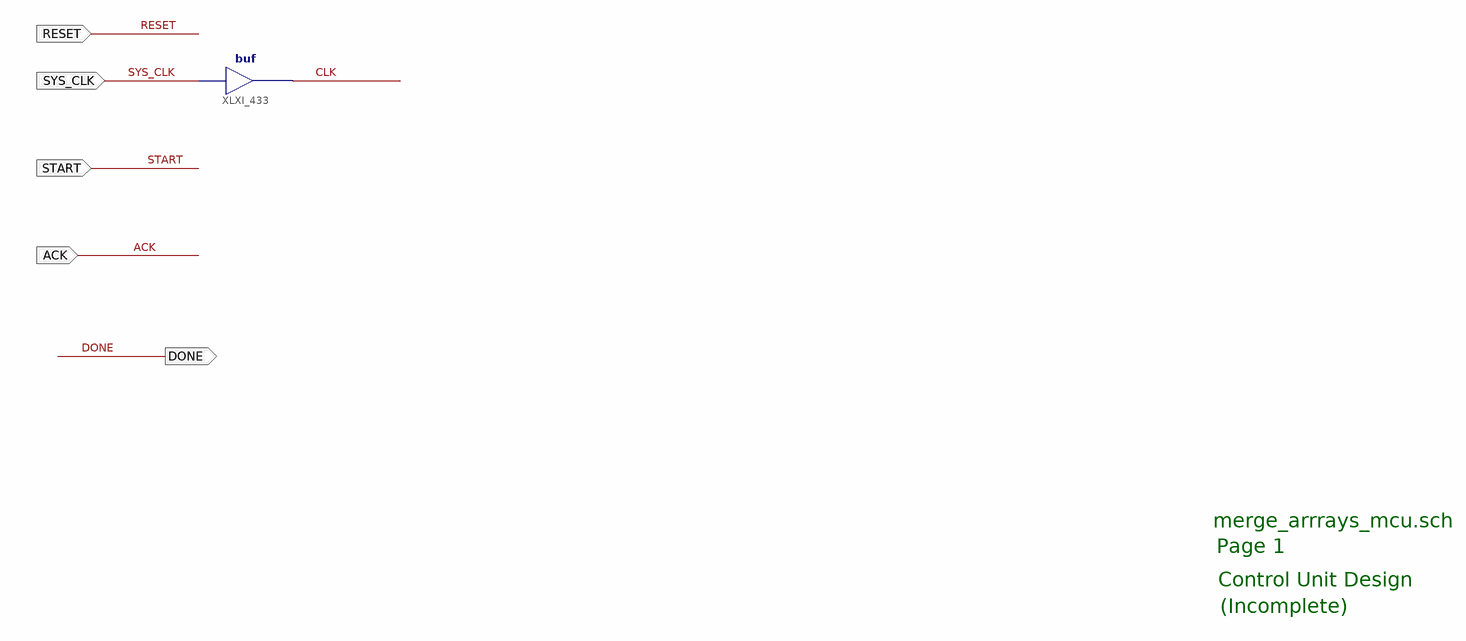
[diagram p0: schematic sheet 1]
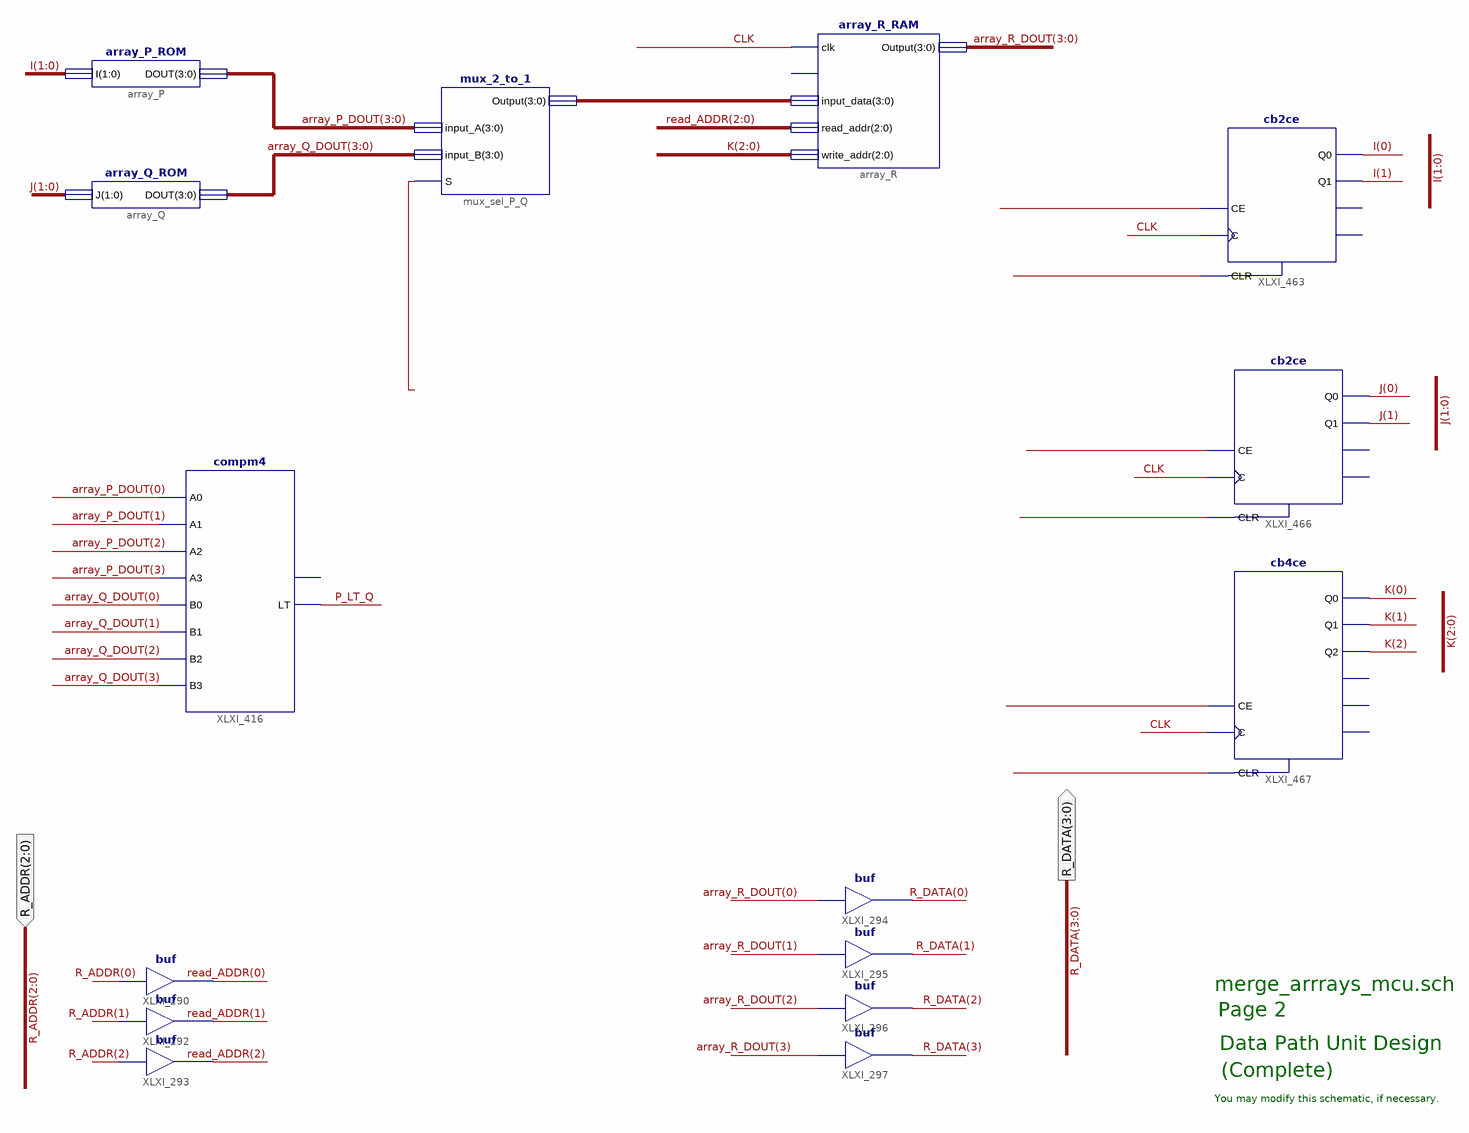
[diagram p1: schematic sheet 2]
// Xilinx ISE schematic merge_arrays_mcu.sch (spartan6) as structural Verilog: 16 symbols, 7 ports
module merge_arrays_mcu (
  input  ACK,
  input  RESET,
  input  SYS_CLK,
  input  START,
  input  [2:0] R_ADDR,
  output [3:0] R_DATA,
  output DONE
);

  wire CLK, P_LT_Q, XLXN_798, XLXN_799, XLXN_800, XLXN_801, XLXN_802, XLXN_803, XLXN_804;
  wire [1:0] I, J;
  wire [2:0] K, read_ADDR;
  wire [3:0] array_P_DOUT, array_Q_DOUT, array_R_DOUT, XLXN_149;

  array_P_ROM array_P (.I(I), .DOUT(array_P_DOUT));
  array_Q_ROM array_Q (.J(J), .DOUT(array_Q_DOUT));
  mux_2_to_1 mux_sel_P_Q (.input_A(array_P_DOUT), .input_B(array_Q_DOUT), .Output(XLXN_149), .S(XLXN_798));
  array_R_RAM array_R (
    .clk(CLK), .input_data(XLXN_149), .read_addr(read_ADDR), .write_addr(K), .Output(array_R_DOUT));  // open: write_EN
  buf XLXI_294 (R_DATA[0], array_R_DOUT[0]);
  buf XLXI_295 (R_DATA[1], array_R_DOUT[1]);
  buf XLXI_296 (R_DATA[2], array_R_DOUT[2]);
  buf XLXI_297 (R_DATA[3], array_R_DOUT[3]);
  compm4 XLXI_416 (
    .A0(array_P_DOUT[0]), .A1(array_P_DOUT[1]), .A2(array_P_DOUT[2]), .A3(array_P_DOUT[3]),
    .B0(array_Q_DOUT[0]), .B1(array_Q_DOUT[1]), .B2(array_Q_DOUT[2]), .B3(array_Q_DOUT[3]), .LT(P_LT_Q));  // open: GT
  buf XLXI_290 (read_ADDR[0], R_ADDR[0]);
  buf XLXI_292 (read_ADDR[1], R_ADDR[1]);
  buf XLXI_293 (read_ADDR[2], R_ADDR[2]);
  buf XLXI_433 (CLK, SYS_CLK);
  cb2ce XLXI_463 (.C(CLK), .CE(XLXN_799), .CLR(XLXN_800), .Q0(I[0]), .Q1(I[1]));  // open: CEO, TC
  cb2ce XLXI_466 (.C(CLK), .CE(XLXN_801), .CLR(XLXN_802), .Q0(J[0]), .Q1(J[1]));  // open: CEO, TC
  cb4ce XLXI_467 (.C(CLK), .CE(XLXN_803), .CLR(XLXN_804), .Q0(K[0]), .Q1(K[1]), .Q2(K[2]));  // open: CEO, Q3, TC

  // Notes on the sheet:
  //   merge_arrrays_mcu.sch
  //   Page 1
  //   Control Unit Design
  //   (Incomplete)
  //   merge_arrrays_mcu.sch
  //   Page 2
  //   Data Path Unit Design
  //   (Complete)
  //   You may modify this schematic, if necessary.
endmodule
